# EAGLE design CellarRemote_I2CExt (EAGLE 7.2.0)
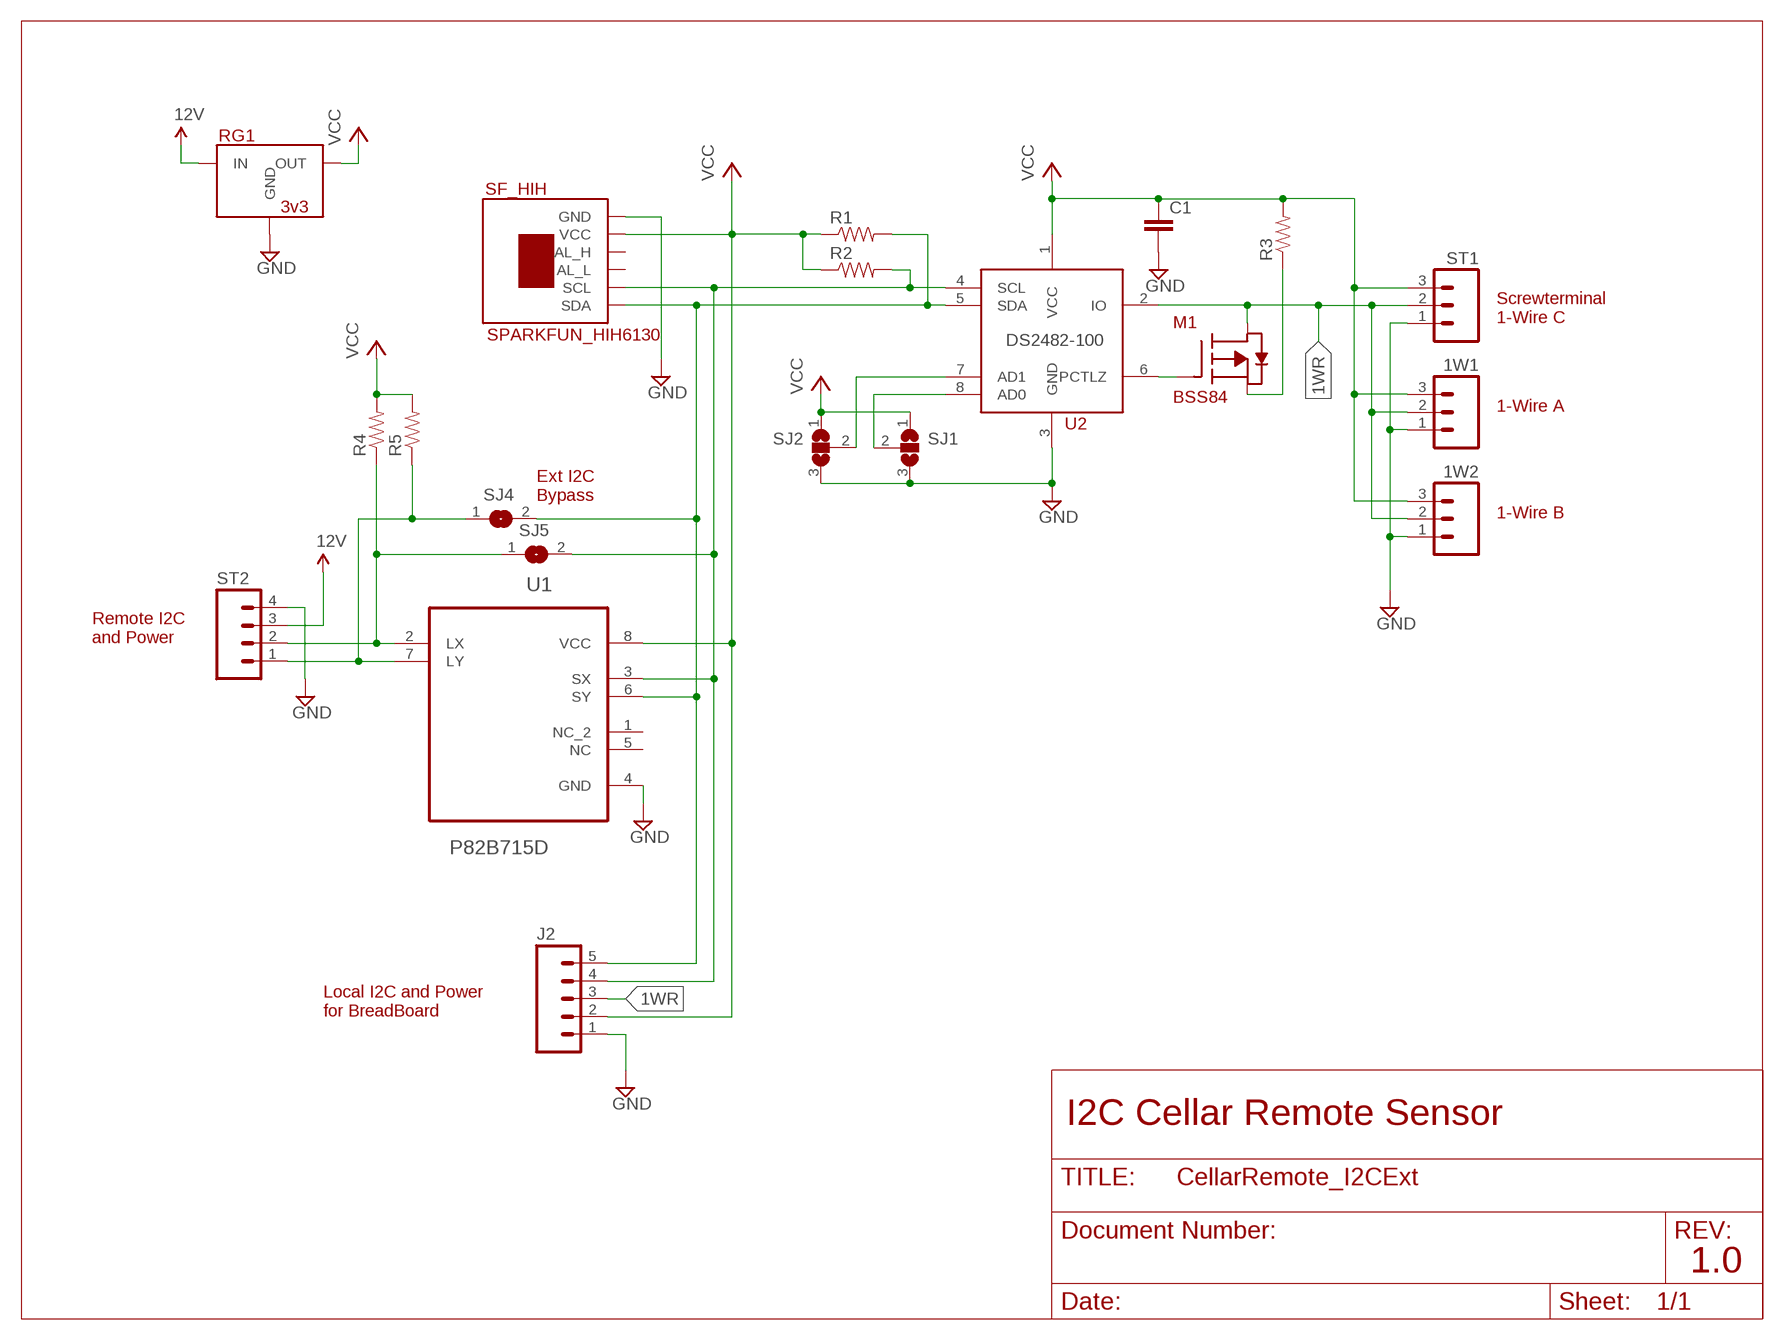
[diagram p0: schematic, sheet 1]

## Parts
1W1  M03PTH  [1X03]
1W2  M03PTH  [1X03]
C1  CAP0603-CAP  [0603-CAP]
J2  M05PTH  [1X05]
M1  BSS84  [SOT-23]
R1  RESISTOR0603  [0603-RES]
R2  RESISTOR0603  [0603-RES]
R3  RESISTORPTH-1/4W  [AXIAL-0.4]
R4  RESISTOR0805-RES  [0805]
R5  RESISTOR0805-RES  [0805]
RG1  3v3  MURATA_REG  [MURATA_REG_HOR]
SF_HIH  SPARKFUN_HIH6130  [SPARKFUN_HIH6130]
SJ1  SJ2W  [SJ_2]
SJ2  SJ2W  [SJ_2]
SJ4  SJ  [SJ]
SJ5  SJ  [SJ]
ST1  SCREWTERM_3  [SCREWTERM_0.2X3]
ST2  SCREWTERM_4  [SCREWTERM_0.2X4]
U1  P82B715D  [SOIC127P600X175-8N]
U2  DS2482-100  [SOIC8]

## Nets
1WR: 1W1.2 1W2.2 J2.3 M1.3 ST1.2 U2.2(IO)
12V: RG1.1(IN) ST2.3
AD0: SJ1.2 U2.8(AD0)
AD1: SJ2.2 U2.7(AD1)
GND: 1W1.1 1W2.1 C1.2 J2.1 RG1.2(GND) SF_HIH.GND SJ1.3 SJ2.3 ST1.1 ST2.4 U1.4(GND) U2.3(GND)
N$1: M1.1 U2.6(PCTLZ)
N$4: R4.1 SJ5.1 ST2.2 U1.2(LX)
N$5: R5.1 SJ4.1 ST2.1 U1.7(LY)
N$10: M1.2 R3.P$1
SCL: J2.4 R2.2 SF_HIH.SCL SJ5.2 U1.3(SX) U2.4(SCL)
SDA: J2.5 R1.2 SF_HIH.SDA SJ4.2 U1.6(SY) U2.5(SDA)
VCC: 1W1.3 1W2.3 C1.1 J2.2 R1.1 R2.1 R3.P$2 R4.2 R5.2 RG1.3(OUT) SF_HIH.VCC SJ1.1 SJ2.1 ST1.3 U1.8(VCC) U2.1(VCC)
Unconnected: SF_HIH.AL_H SF_HIH.AL_L U1.1(NC_2) U1.5(NC)

## Notes on the sheet
- Screwterminal
  1-Wire C
- 1-Wire A
- Ext I2C
  Bypass
- 1-Wire B
- Remote I2C
  and Power
- Local I2C and Power
  for BreadBoard
- I2C Cellar Remote Sensor
- 1.0

## Library data of the parts
1W1 1W2 = SparkFun-Connectors:M03: Header 3 Standard 3-pin 0.1" header. Use with straight break away headers (SKU : PRT-00116), right angle break away headers (PRT-00553), swiss pins (PRT-00743), machine pins (PRT-00117), and female headers (PRT-00115). Molex polarized connector foot print use with SKU : PRT-08232 with associated crimp pins and housings.
C1 = SparkFun-Capacitors:CAP: Capacitor Standard 0603 ceramic capacitor, and 0.1" leaded capacitor.
J2 = SparkFun-Connectors:M05: Header 5 Standard 5-pin 0.1" header. Use with straight break away headers (SKU : PRT-00116), right angle break away headers (PRT-00553), swiss pins (PRT-00743), machine pins (PRT-00117), and female headers (PRT-00115). Molex polarized connector foot print use with SKU : PRT-08230 with associated crimp pins and housings.
M1 = Puffin:BSS84: BSS84 P-Channel Enhancement Mode Field-Effect Transistor
R1-R5 = SparkFun-Resistors:RESISTOR: Resistor Basic schematic elements and footprints for 0603, 1206, and PTH resistors.
RG1 = Puffin:MURATA_REG
SF_HIH = Puffin:SPARKFUN_HIH6130: SparkFun HIH6130 Breakout Board
SJ1 SJ2 = jumper:SJ2W: SMD solder JUMPER
SJ4 SJ5 = jumper:SJ: SMD solder JUMPER
ST1 = Puffin:SCREWTERM_3
ST2 = Puffin:SCREWTERM_4
U1 = Texas Instruments_By_element14_Batch_1:P82B715D: I2C BUS EXTENDER; MPN: P82B715D; OC_FARNELL: 1604945; OC_NEWARK: 84M9793; PACKAGE: SOIC-8; SUPPLIER: Texas Instruments
U2 = PuffinOneWIre:DS2482-100: DS2482-100 I2C-to-1-Wire® bridge device

## Net classes
0 default: clearance 0.205 mm

## Board
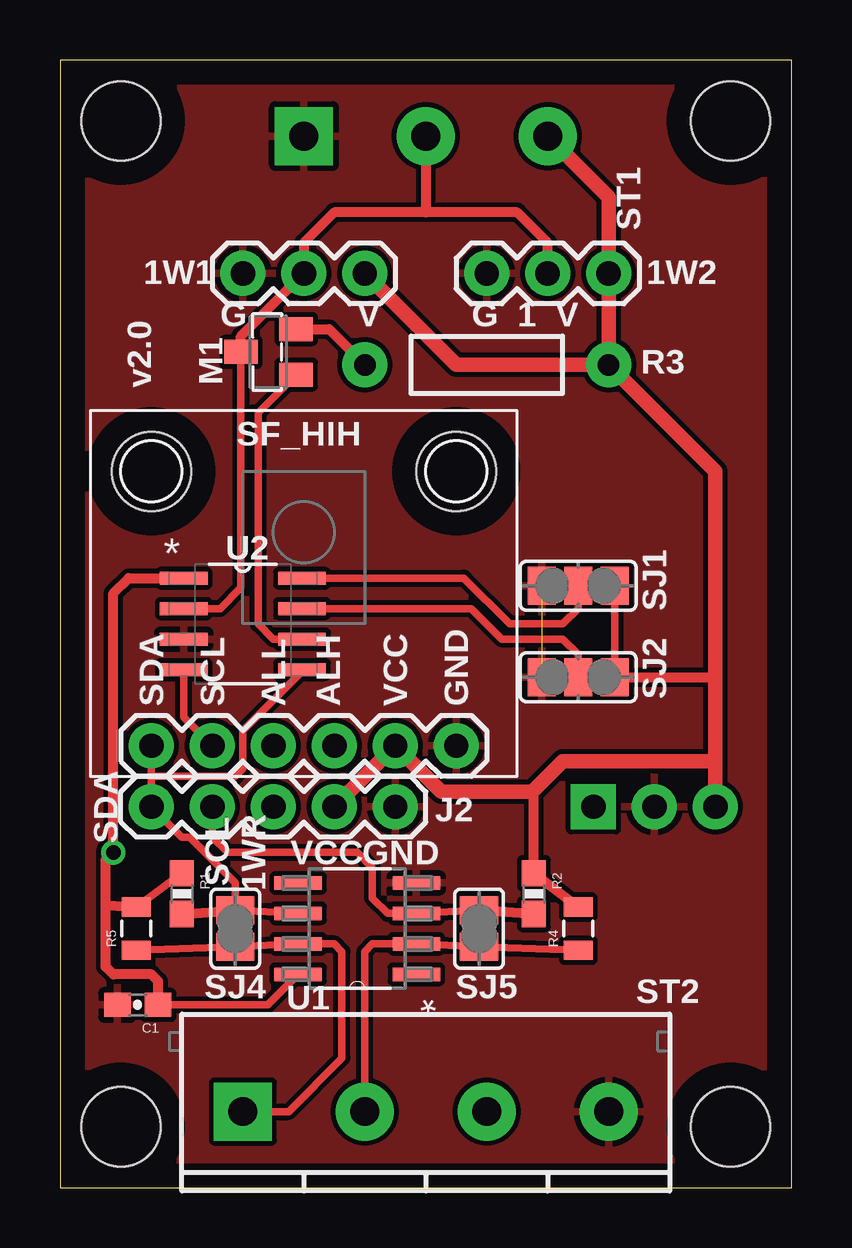
[diagram p1: board, top side]
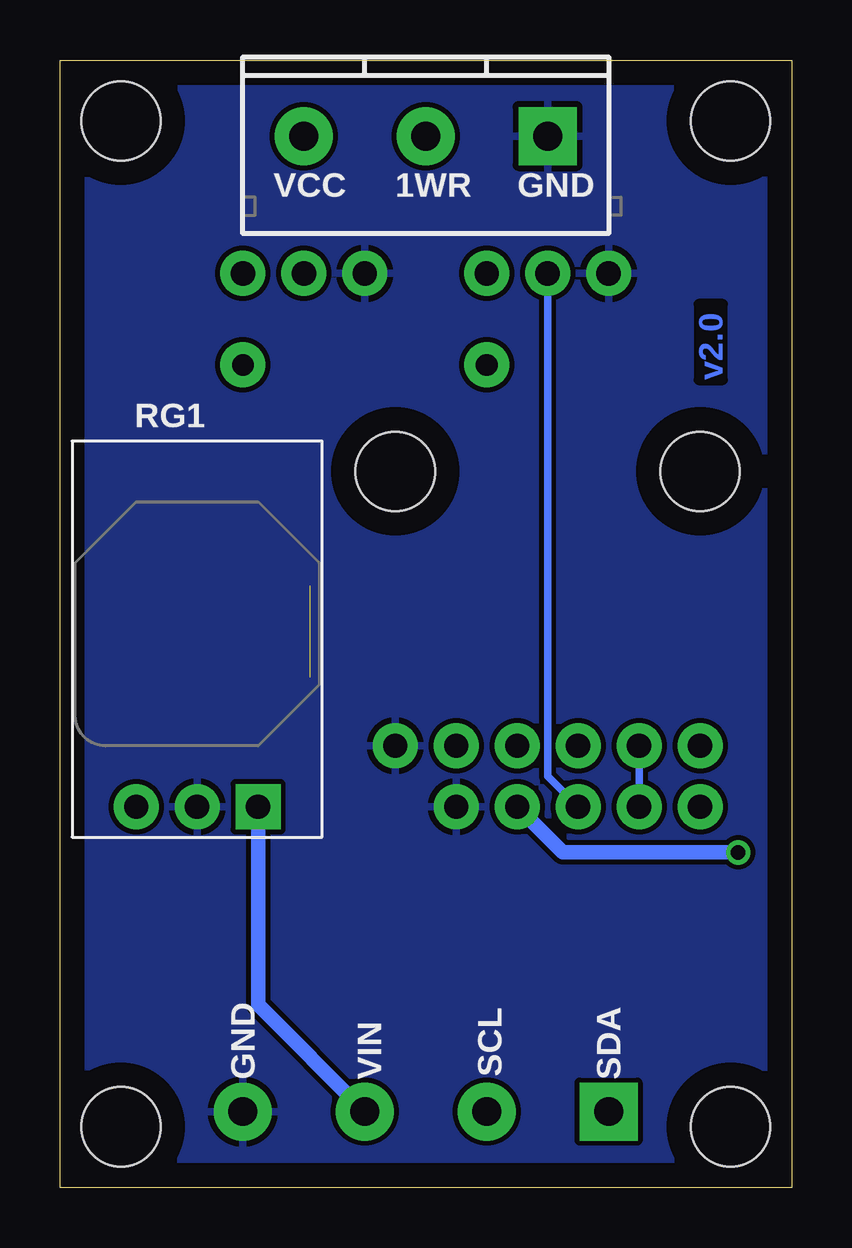
[diagram p2: board, bottom side, seen from below]

Size 30.48 x 46.99 mm. Coordinates in mm from the lower left corner, seen from the top.
Outline: 0,0 30.48,0 30.48,46.99 0,46.99 0,0
Copper layers (1*16): Top 0.035mm / dielectric 1.5mm / Bottom 0.035mm
Design rules "default": minimum track width 10mil, minimum drill 24mil, track to track 8mil, track to pad 8mil, pad to pad 8mil, via to via 8mil, smd to smd 8mil, copper to edge 40mil, drill to drill 8mil, minimum pad ring 10mil, minimum via ring 8mil, stop-mask expansion 4mil, vias tented up to drill 0mil, thermal gap 10mil

### Footprints (pad centres in the part's own frame; a part is rotated, then mirrored left to right if it is on the bottom)
1X03 = drill 1.016 pad 1.88: 1 0,0; 2 2.54,0; 3 5.08,0
0603-CAP = smd 1.1 x 1: 1 -0.85,0; 2 0.85,0
1X05 = drill 1.016 pad 1.88: 1 0,0; 2 2.54,0; 3 5.08,0; 4 7.62,0; 5 10.16,0
SOT-23 = smd 1 x 1.4: 1 -0.92,-1.2; 2 0.98,-1.2; 3 0.03,1.1
0603-RES = smd 1.1 x 1: 1 -0.85,0; 2 0.85,0
AXIAL-0.4 = drill 0.9 pad 1.88: P$1 -5.08,0; P$2 5.08,0
0805 = smd 0.8 x 1.2: 1 -0.9,0; 2 0.9,0
MURATA_REG_HOR = drill 1.016 pad 1.88 square: 1 2.54,0 | drill 1.016 pad 1.88: 2 0,0; 3 -2.54,0
SPARKFUN_HIH6130 = drill 1.016 pad 1.88: AL_H 1.27,0; AL_L -1.27,0; GND 6.35,0; SCL -3.81,0; SDA -6.35,0; VCC 3.81,0
SJ_2 = smd 1.168 x 1.6: 1 -1.524,0; 2 0,0; 3 1.524,0
SJ = smd 1.168 x 1.6: 1 -0.762,0; 2 0.762,0
SCREWTERM_0.2X3 = drill 1.2 pad 2.413 square: 1 0,0 | drill 1.2 pad 2.413: 2 5.08,0; 3 10.16,0
SCREWTERM_0.2X4 = drill 1.2 pad 2.413 square: 1 0,0 | drill 1.2 pad 2.413: 2 5.08,0; 3 10.16,0; 4 15.24,0
SOIC127P600X175-8N = smd 1.981 x 0.559: 1 -2.464,1.905; 2 -2.464,0.635; 3 -2.464,-0.635; 4 -2.464,-1.905; 5 2.464,-1.905; 6 2.464,-0.635; 7 2.464,0.635; 8 2.464,1.905
SOIC8 = smd 1.981 x 0.533: 1 -2.464,1.905; 2 -2.464,0.635; 3 -2.464,-0.635; 4 -2.464,-1.905; 5 2.464,-1.905; 6 2.464,-0.635; 7 2.464,0.635; 8 2.464,1.905
STAND-OFF = hole 3.302: 0,0

### Placement (x,y rotation side)
1W1  7.62,38.1 0 top
1W2  17.78,38.1 0 top
C1  3.24,7.62 180 top
J2  13.97,15.88 180 top
M1  8.64,34.8 90 top
R1  5.08,12.26 270 top
R2  19.75,12.26 270 top
R3  17.78,34.29 0 top
R4  21.59,10.79 90 top
R5  3.17,10.79 90 top
RG1  24.77,15.88 0 bottom
SF_HIH  10.16,18.41 0 top
SJ1  21.59,25.08 180 top
SJ2  21.59,21.27 180 top
SJ4  7.3,10.79 90 top
SJ5  17.46,10.79 90 top
ST1  10.16,43.81 180 bottom
ST2  7.62,3.17 0 top
U1  12.38,10.79 180 top
U2  7.62,23.5 0 top
U$1  [STAND-OFF]  2.54,2.54 0 top
U$2  [STAND-OFF]  27.94,2.54 0 top
U$3  [STAND-OFF]  27.94,44.45 0 top
U$4  [STAND-OFF]  2.54,44.45 0 top
U$6  [STAND-OFF]  3.81,29.84 0 top
U$7  [STAND-OFF]  16.51,29.84 0 top

### Tracks (layer width: path | path; a pad name or v marks a point on that pad's centre or on a via)
1WR
  Top 0.305: M1.3 7.54,25 6.67,24.13 U2.2
  Top 0.406: 1W2.2 20.32,39.37 19.05,40.64 15.24,40.64 | 15.24,40.64 11.43,40.64 10.16,39.37 1W1.2 7.54,35.48 M1.3 | ST1.2 15.24,40.64
  Bottom 0.305: J2.3 10.16,17.14 1W1.2
12V
  Bottom 0.61: ST2.3 22.23,7.62 RG1.1
AD0
  Top 0.305: U2.8 16.83,25.4 18.73,23.5 20.95,23.5 21.59,24.13 SJ1.2
AD1
  Top 0.305: SJ2.2 21.59,22.23 20.95,22.86 18.41,22.86 17.14,24.13 U2.7
GND  (1 unrouted)
  pour Bottom: -0.51,47.5 32.26,47.5 32.26,-1.14 -0.51,-1.14
  pour Top: -0.25,47.88 32,47.88 32,-0.89 -0.25,-0.89
N$1
  Top 0.305: U2.6 8.89,22.86 8.26,23.5 8.26,32.3 M1.1
N$4
  Top 0.305: R4.1 SJ5.1 U1.2 13.02,10.16 12.7,9.84 ST2.2
N$5
  Top 0.305: R5.1 SJ4.1 U1.7 11.43,10.16 11.75,9.84 11.75,5.4 9.53,3.17 ST2.1
N$10
  Top 0.406: M1.2 11.21,35.78 R3.P$1
SCL
  Top 0.305: SJ5.2 U1.3 13.65,11.43 13.02,12.06 13.02,13.34 12.38,13.97 6.99,13.97 6.35,14.61 J2.4 | SF_HIH.SCL 5.16,19.61 U2.4
  Top 0.406: R2.2 SJ5.2
  Bottom 0.305: SF_HIH.SCL J2.4
SDA
  Top 0.305: 3.81,17.14 J2.5 5.08,14.61 5.4,14.61 7.3,12.7 SJ4.2 U1.6 | 3.81,17.14 SF_HIH.SDA | U2.5 10.08,21.51 7.62,19.05 7.62,17.46 7.3,17.14 3.81,17.14
  Top 0.406: R1.2 SJ4.2
VCC  (via drill 0.6)
  Top 0.305: C1.1 8.65,7.62 U1.8 | R1.1 R5.2 | SJ1.1 SJ2.1
  Top 0.406: U2.1 2.86,25.4 2.22,24.77 v2.22,13.97 1.91,13.65 1.91,11.75 | SJ2.1 27.3,21.27 | 19.68,16.51 19.75,16.45 R2.1 R4.2 | C1.1 4.09,8.61 3.81,8.89 2.22,8.89 1.91,9.21 1.91,11.75 | R5.2 1.91,11.75
  Top 0.61: RG1.3 27.3,17.78 | 27.3,17.78 27.3,21.27 27.3,29.84 R3.P$2 | R3.P$2 1W2.3 22.86,41.27 ST1.3 | 1W1.3 16.51,34.29 R3.P$2 | 27.3,17.78 20.95,17.78 19.68,16.51 15.88,16.51 SF_HIH.VCC J2.2
  Bottom 0.61: J2.2 9.53,13.97 v2.22,13.97

### Text on the board
Bottom: v2.0
tPlace: G | V | G 1 V | v2.0 | SDA | VCC | GND | SCL | 1WR
bPlace: GND | 1WR | VCC | SDA | SCL | VIN | GND